# Altium schematic sheet template_Schematic_v1.0.SchDoc
size C
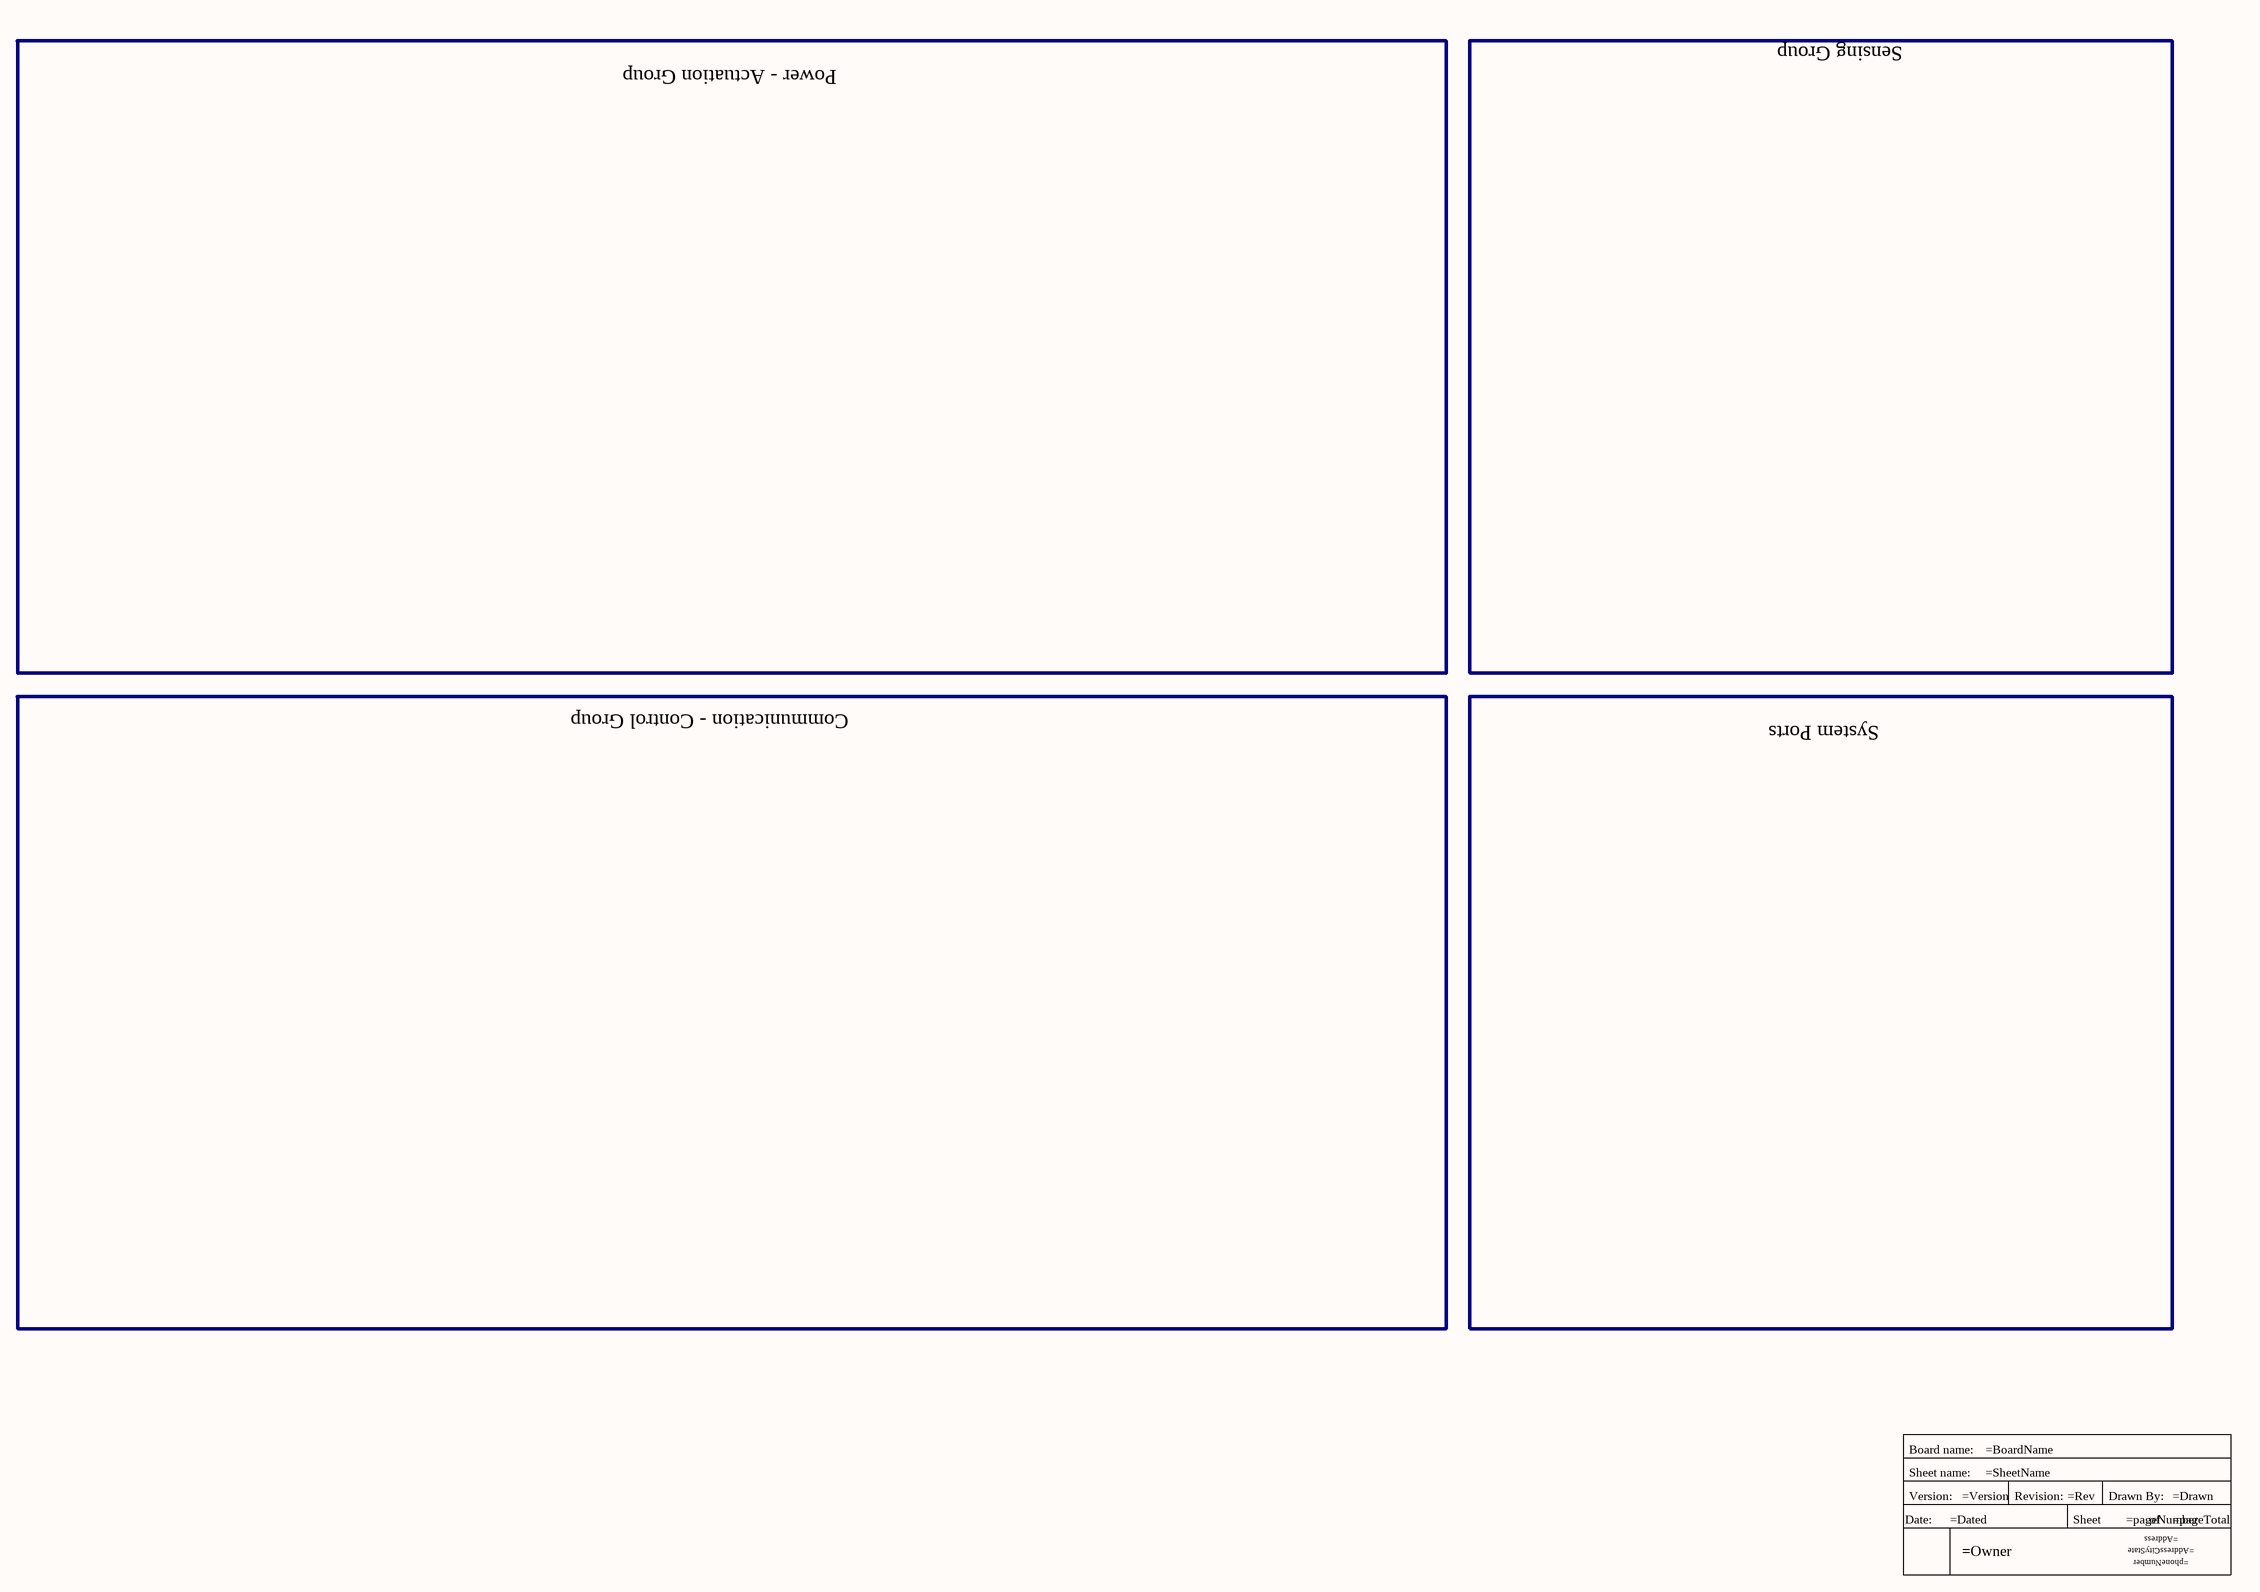
[diagram p0: template_Schematic_v1.0.SchDoc]

## Parts
?  Title_Block_noClient  (value not drawn)  (graphical)

## Notes on the sheet
- Sensing Group
- Power - Actuation Group
- Communication - Control Group
- System Ports
- (in symbol Title_Block_noClient) Board name:; Sheet name:; Version:; Revision:; Drawn By:; Date:; Sheet; of

## Library data of the parts
? = Title_Block_noClient: Schematic title block; Sheet: =SheetName; Owner: =Owner; Version: =Version; totalPageNumber: =pageTotal; Rev: =Rev; pageNumber: =pageNumber; latestDate: =Dated; drawn: =Drawn; BoardName: =BoardName